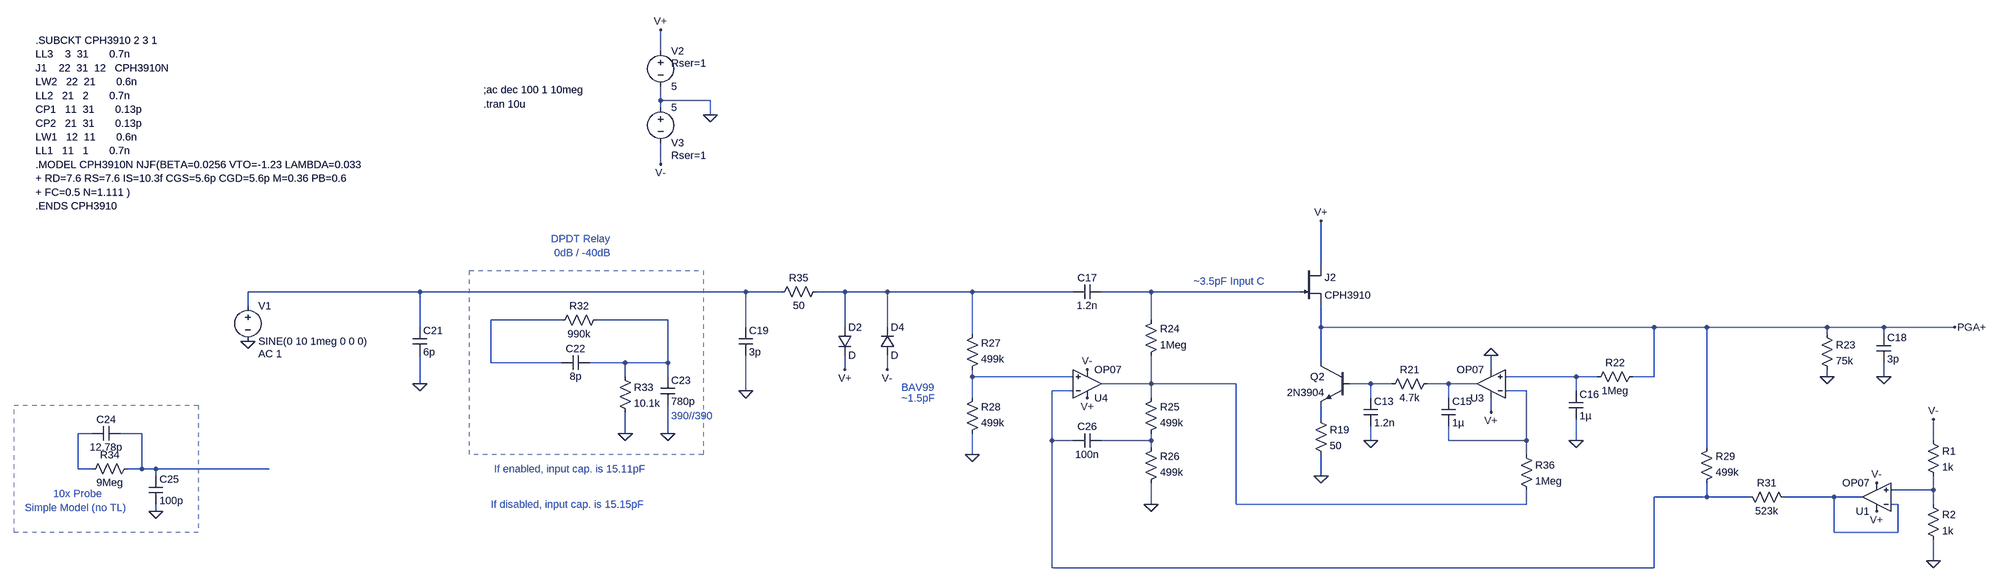
[diagram p0: schematic Rev4_Buffer_Amp.asc]
Rev4_Buffer_Amp.asc, the LTspice schematic file:
Version 4
SHEET 1 3636 912
WIRE 336 -1936 336 -1984
WIRE 336 -1824 336 -1856
WIRE 448 -1824 336 -1824
WIRE 336 -1808 336 -1824
WIRE 448 -1792 448 -1824
WIRE 336 -1680 336 -1728
WIRE 1856 -1456 1856 -1552
WIRE -208 -1392 -608 -1392
WIRE 528 -1392 -208 -1392
WIRE 608 -1392 528 -1392
WIRE 752 -1392 688 -1392
WIRE 848 -1392 752 -1392
WIRE 1040 -1392 848 -1392
WIRE 1296 -1392 1040 -1392
WIRE 1472 -1392 1360 -1392
WIRE 1808 -1392 1472 -1392
WIRE -608 -1360 -608 -1392
WIRE 112 -1328 -48 -1328
WIRE 352 -1328 192 -1328
WIRE 1472 -1328 1472 -1392
WIRE -208 -1312 -208 -1392
WIRE 528 -1312 528 -1392
WIRE 752 -1312 752 -1392
WIRE 848 -1312 848 -1392
WIRE 1856 -1312 1856 -1360
WIRE 2608 -1312 1856 -1312
WIRE 2752 -1312 2608 -1312
WIRE 3024 -1312 2752 -1312
WIRE 3152 -1312 3024 -1312
WIRE 3312 -1312 3152 -1312
WIRE 1040 -1296 1040 -1392
WIRE 3024 -1296 3024 -1312
WIRE 3152 -1296 3152 -1312
WIRE -48 -1232 -48 -1328
WIRE 112 -1232 -48 -1232
WIRE 256 -1232 176 -1232
WIRE 352 -1232 352 -1328
WIRE 352 -1232 256 -1232
WIRE 1856 -1232 1856 -1312
WIRE 752 -1216 752 -1248
WIRE 848 -1216 848 -1248
WIRE 2240 -1216 2240 -1248
WIRE 256 -1200 256 -1232
WIRE 352 -1200 352 -1232
WIRE 1040 -1200 1040 -1216
WIRE 1296 -1200 1040 -1200
WIRE 2432 -1200 2272 -1200
WIRE 2480 -1200 2432 -1200
WIRE 2608 -1200 2608 -1312
WIRE 2608 -1200 2560 -1200
WIRE 3024 -1200 3024 -1216
WIRE 3152 -1200 3152 -1232
WIRE -208 -1184 -208 -1248
WIRE 1472 -1184 1472 -1248
WIRE 1472 -1184 1360 -1184
WIRE 1664 -1184 1472 -1184
WIRE 1968 -1184 1920 -1184
WIRE 2016 -1184 1968 -1184
WIRE 2144 -1184 2096 -1184
WIRE 2208 -1184 2144 -1184
WIRE 528 -1168 528 -1248
WIRE 1296 -1168 1248 -1168
WIRE 2320 -1168 2272 -1168
WIRE 2432 -1168 2432 -1200
WIRE 1040 -1152 1040 -1200
WIRE 1472 -1152 1472 -1184
WIRE 1968 -1152 1968 -1184
WIRE 2144 -1152 2144 -1184
WIRE 2240 -1120 2240 -1152
WIRE 1856 -1104 1856 -1136
WIRE -960 -1072 -992 -1072
WIRE -848 -1072 -896 -1072
WIRE 256 -1072 256 -1120
WIRE 352 -1072 352 -1136
WIRE 1248 -1056 1248 -1168
WIRE 1296 -1056 1248 -1056
WIRE 1472 -1056 1472 -1072
WIRE 1472 -1056 1360 -1056
WIRE 1968 -1056 1968 -1088
WIRE 2144 -1056 2144 -1088
WIRE 2320 -1056 2320 -1168
WIRE 2320 -1056 2144 -1056
WIRE 2432 -1056 2432 -1104
WIRE 3264 -1056 3264 -1104
WIRE 1472 -1040 1472 -1056
WIRE 2752 -1040 2752 -1312
WIRE 1040 -1024 1040 -1072
WIRE 2320 -1024 2320 -1056
WIRE -992 -992 -992 -1072
WIRE -960 -992 -992 -992
WIRE -848 -992 -848 -1072
WIRE -848 -992 -880 -992
WIRE -816 -992 -848 -992
WIRE -560 -992 -816 -992
WIRE -816 -976 -816 -992
WIRE 1856 -976 1856 -1024
WIRE 3264 -944 3264 -976
WIRE 3264 -944 3168 -944
WIRE 2752 -928 2752 -960
WIRE 2752 -928 2608 -928
WIRE 2848 -928 2752 -928
WIRE 3040 -928 2928 -928
WIRE 3104 -928 3040 -928
WIRE 1472 -912 1472 -960
WIRE 1664 -912 1664 -1184
WIRE 2320 -912 2320 -944
WIRE 2320 -912 1664 -912
WIRE 3184 -912 3168 -912
WIRE 3264 -912 3264 -944
WIRE -816 -896 -816 -912
WIRE 3040 -848 3040 -928
WIRE 3184 -848 3184 -912
WIRE 3184 -848 3040 -848
WIRE 3264 -784 3264 -832
WIRE 1248 -768 1248 -1056
WIRE 2608 -768 2608 -928
WIRE 2608 -768 1248 -768
FLAG 448 -1792 0
FLAG 336 -1984 V+
FLAG 336 -1680 V-
FLAG 1856 -1552 V+
FLAG 2240 -1120 V+
FLAG 1968 -1056 0
FLAG 2432 -1056 0
FLAG -608 -1280 0
FLAG 3024 -1200 0
FLAG 3152 -1200 0
FLAG 3312 -1312 PGA+
FLAG 1328 -1152 V+
FLAG 1328 -1216 V-
FLAG 1040 -1024 0
FLAG 1472 -912 0
FLAG 528 -1168 0
FLAG -208 -1184 0
FLAG 256 -1072 0
FLAG 352 -1072 0
FLAG -816 -896 0
FLAG 1856 -976 0
FLAG 2240 -1248 0
FLAG 3136 -960 V-
FLAG 3136 -896 V+
FLAG 3264 -784 0
FLAG 3264 -1104 V-
FLAG 752 -1216 V+
FLAG 848 -1216 V-
SYMBOL voltage 336 -1952 R0
WINDOW 123 0 0 Left 0
WINDOW 39 24 44 Left 2
SYMATTR SpiceLine Rser=1
SYMATTR InstName V2
SYMATTR Value 5
SYMBOL voltage 336 -1824 R0
WINDOW 0 24 96 Left 2
WINDOW 3 24 16 Left 2
WINDOW 123 0 0 Left 0
WINDOW 39 24 124 Left 2
SYMATTR InstName V3
SYMATTR Value 5
SYMATTR SpiceLine Rser=1
SYMBOL npn 1920 -1232 M0
SYMATTR InstName Q2
SYMATTR Value 2N3904
SYMBOL res 1840 -1120 R0
SYMATTR InstName R19
SYMATTR Value 50
SYMBOL Opamps\\OP07 2240 -1120 R180
SYMATTR InstName U3
SYMBOL res 2112 -1200 R90
WINDOW 0 0 56 VBottom 2
WINDOW 3 32 56 VTop 2
SYMATTR InstName R21
SYMATTR Value 4.7k
SYMBOL cap 1952 -1152 R0
SYMATTR InstName C13
SYMATTR Value 1.2n
SYMBOL cap 2128 -1152 R0
SYMATTR InstName C15
SYMATTR Value 1µ
SYMBOL res 2576 -1216 R90
WINDOW 0 0 56 VBottom 2
WINDOW 3 32 56 VTop 2
SYMATTR InstName R22
SYMATTR Value 1Meg
SYMBOL cap 2416 -1168 R0
SYMATTR InstName C16
SYMATTR Value 1µ
SYMBOL cap 1360 -1408 R90
WINDOW 0 0 32 VBottom 2
WINDOW 3 32 32 VTop 2
SYMATTR InstName C17
SYMATTR Value 1.2n
SYMBOL voltage -608 -1376 R0
WINDOW 123 24 124 Left 2
WINDOW 39 24 152 Left 2
SYMATTR Value2 AC 1
SYMATTR InstName V1
SYMATTR Value SINE(0 10 1meg 0 0 0)
SYMBOL res 3008 -1312 R0
SYMATTR InstName R23
SYMATTR Value 75k
SYMBOL cap 3136 -1296 R0
SYMATTR InstName C18
SYMATTR Value 3p
SYMBOL Opamps\\OP07 1328 -1120 M180
SYMATTR InstName U4
SYMBOL res 1456 -1232 M180
WINDOW 0 36 76 Left 2
WINDOW 3 36 40 Left 2
SYMATTR InstName R24
SYMATTR Value 1Meg
SYMBOL res 1456 -1056 M180
WINDOW 0 36 76 Left 2
WINDOW 3 36 40 Left 2
SYMATTR InstName R25
SYMATTR Value 499k
SYMBOL res 1456 -944 M180
WINDOW 0 36 76 Left 2
WINDOW 3 36 40 Left 2
SYMATTR InstName R26
SYMATTR Value 499k
SYMBOL res 1024 -1200 M180
WINDOW 0 36 76 Left 2
WINDOW 3 36 40 Left 2
SYMATTR InstName R27
SYMATTR Value 499k
SYMBOL res 1024 -1056 M180
WINDOW 0 36 76 Left 2
WINDOW 3 36 40 Left 2
SYMATTR InstName R28
SYMATTR Value 499k
SYMBOL res 2736 -944 M180
WINDOW 0 36 76 Left 2
WINDOW 3 36 40 Left 2
SYMATTR InstName R29
SYMATTR Value 499k
SYMBOL res 2944 -912 M270
WINDOW 0 32 56 VTop 2
WINDOW 3 0 56 VBottom 2
SYMATTR InstName R31
SYMATTR Value 523k
SYMBOL cap 512 -1312 R0
SYMATTR InstName C19
SYMATTR Value 3p
SYMBOL cap -224 -1312 R0
SYMATTR InstName C21
SYMATTR Value 6p
SYMBOL res 208 -1344 R90
WINDOW 0 0 56 VBottom 2
WINDOW 3 32 56 VTop 2
SYMATTR InstName R32
SYMATTR Value 990k
SYMBOL cap 176 -1248 R90
WINDOW 0 0 32 VBottom 2
WINDOW 3 32 32 VTop 2
SYMATTR InstName C22
SYMATTR Value 8p
SYMBOL res 240 -1216 R0
SYMATTR InstName R33
SYMATTR Value 10.1k
SYMBOL cap 336 -1200 R0
SYMATTR InstName C23
SYMATTR Value 780p
SYMBOL res -864 -1008 R90
WINDOW 0 0 56 VBottom 2
WINDOW 3 32 56 VTop 2
SYMATTR InstName R34
SYMATTR Value 9Meg
SYMBOL cap -896 -1088 R90
WINDOW 0 0 32 VBottom 2
WINDOW 3 32 32 VTop 2
SYMATTR InstName C24
SYMATTR Value 12.78p
SYMBOL cap -832 -976 R0
SYMATTR InstName C25
SYMATTR Value 100p
SYMBOL cap 1360 -1040 M270
WINDOW 0 32 32 VTop 2
WINDOW 3 0 32 VBottom 2
SYMATTR InstName C26
SYMATTR Value 100n
SYMBOL njf 1808 -1456 R0
SYMATTR InstName J2
SYMATTR Value CPH3910
SYMATTR Prefix X
SYMBOL res 704 -1408 R90
WINDOW 0 0 56 VBottom 2
WINDOW 3 32 56 VTop 2
SYMATTR InstName R35
SYMATTR Value 50
SYMBOL diode 736 -1312 R0
SYMATTR InstName D2
SYMBOL diode 832 -1248 M180
WINDOW 0 24 64 Left 2
WINDOW 3 24 0 Left 2
SYMATTR InstName D4
SYMBOL res 2304 -1040 R0
SYMATTR InstName R36
SYMATTR Value 1Meg
SYMBOL Opamps\\OP07 3136 -864 R180
SYMATTR InstName U1
SYMBOL res 3248 -1072 R0
SYMATTR InstName R1
SYMATTR Value 1k
SYMBOL res 3248 -928 R0
SYMATTR InstName R2
SYMATTR Value 1k
TEXT -64 -1848 Left 2 !;ac dec 100 1 10meg
TEXT -64 -1816 Left 2 !.tran 10u
TEXT -1088 -1960 Left 2 !.SUBCKT CPH3910 2 3 1\nLL3    3  31       0.7n\nJ1    22  31  12   CPH3910N\nLW2   22  21       0.6n \nLL2   21   2       0.7n  \nCP1   11  31       0.13p\nCP2   21  31       0.13p\nLW1   12  11       0.6n\nLL1   11   1       0.7n\n.MODEL CPH3910N NJF(BETA=0.0256 VTO=-1.23 LAMBDA=0.033\n+ RD=7.6 RS=7.6 IS=10.3f CGS=5.6p CGD=5.6p M=0.36 PB=0.6\n+ FC=0.5 N=1.111 )\n.ENDS CPH3910
TEXT 88 -1512 Left 2 ;DPDT Relay
TEXT 96 -1480 Left 2 ;0dB / -40dB
TEXT -40 -992 Left 2 ;If enabled, input cap. is 15.11pF
TEXT -48 -912 Left 2 ;If disabled, input cap. is 15.15pF
TEXT 360 -1112 Left 2 ;390//390
TEXT -1048 -936 Left 2 ;10x Probe
TEXT -1112 -904 Left 2 ;Simple Model (no TL)
TEXT 1568 -1416 Left 2 ;~3.5pF Input C
TEXT 880 -1176 Left 2 ;BAV99
TEXT 880 -1152 Left 2 ;~1.5pF
RECTANGLE Normal 432 -1024 -96 -1440 2
RECTANGLE Normal -720 -848 -1136 -1136 2

The netlist it stands for:
* Rev4_Buffer_Amp.asc
V2 V+ 0 5 Rser=1
V3 0 V- 5 Rser=1
Q2 PGA+ N009 N013 0 2N3904
R19 N013 0 50
XU3 N007 N012 V+ 0 N010 LT1001  ; OP07, pins In+ In- V+ V- OUT
R21 N010 N009 4.7k
C13 N009 0 1.2n
C15 N010 N012 1µ
R22 PGA+ N007 1Meg
C16 N007 0 1µ
C17 N003 N002 1.2n
V1 N001 0 SINE(0 10 1meg 0 0 0) AC 1
R23 PGA+ 0 75k
C18 PGA+ 0 3p
XU4 N006 N011 V+ V- N008 LT1001  ; OP07, pins In+ In- V+ V- OUT
R24 N008 N003 1Meg
R25 N016 N008 499k
R26 0 N016 499k
R27 N006 N002 499k
R28 0 N006 499k
R29 N011 PGA+ 499k
R31 N018 N011 523k
C19 N001 0 3p
C21 N001 0 6p
R32 N005 N004 990k
C22 N005 N004 8p
R33 N005 0 10.1k
C23 N005 0 780p
R34 N015 N014 9Meg
C24 N015 N014 12.78p
C25 N015 0 100p
C26 N016 N011 100n
XJ2 V+ N003 PGA+ CPH3910  ; pins D G S
R35 N002 N001 50
D2 N002 V+ D
D4 V- N002 D
R36 N012 N008 1Meg
XU1 N017 N018 V+ V- N018 LT1001  ; OP07, pins In+ In- V+ V- OUT
R1 V- N017 1k
R2 N017 0 1k
.model D D
.lib standard.dio
.model NPN NPN
.model PNP PNP
.lib standard.bjt
;ac dec 100 1 10meg
.tran 10u
.SUBCKT CPH3910 2 3 1
LL3    3  31       0.7n
J1    22  31  12   CPH3910N
LW2   22  21       0.6n
LL2   21   2       0.7n
CP1   11  31       0.13p
CP2   21  31       0.13p
LW1   12  11       0.6n
LL1   11   1       0.7n
.MODEL CPH3910N NJF(BETA=0.0256 VTO=-1.23 LAMBDA=0.033
+ RD=7.6 RS=7.6 IS=10.3f CGS=5.6p CGD=5.6p M=0.36 PB=0.6
+ FC=0.5 N=1.111 )
.ENDS CPH3910
* DPDT Relay
* 0dB / -40dB
* If enabled, input cap. is 15.11pF
* If disabled, input cap. is 15.15pF
* 390//390
* 10x Probe
* Simple Model (no TL)
* ~3.5pF Input C
* BAV99
* ~1.5pF
.lib LTC.lib
.backanno
.end